# Altium schematic sheet top.SchDoc
size A4
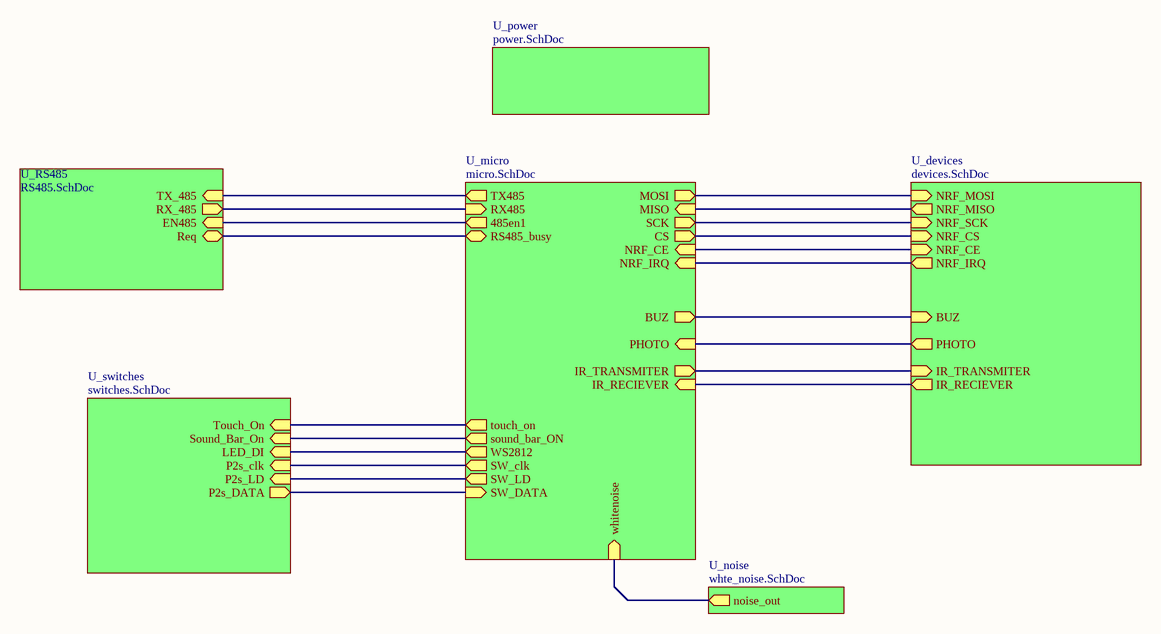
[diagram p0: top.SchDoc]

## Sub-sheets
U_devices = devices.SchDoc: NRF_MISO (out), NRF_SCK (in), NRF_CE (in), NRF_IRQ (out), NRF_CS (in), NRF_MOSI (in), BUZ (in), PHOTO (out), IR_RECIEVER (out), IR_TRANSMITER (in)
U_micro = micro.SchDoc: whitenoise (in), RX485 (in), TX485 (out), 485en1 (out), RS485_busy (bidir), PHOTO (in), NRF_CE (in), WS2812 (out), NRF_IRQ (in), touch_on (out), IR_RECIEVER (in), IR_TRANSMITER (out), sound_bar_ON (out), MOSI (out), MISO (in), SCK (out), CS (out), BUZ (out), SW_DATA (in), SW_clk (out), SW_LD (out)
U_noise = whte_noise.SchDoc: noise_out (out)
U_power = power.SchDoc: no entries
U_RS485 = RS485.SchDoc: RX_485 (out), EN485 (in), TX_485 (in), Req (bidir)
U_switches = switches.SchDoc: P2s_clk (in), P2s_LD (in), P2s_DATA (out), LED_DI (in), Sound_Bar_On (in), Touch_On (in)

## Nets
(unnamed): sheet U_noise/noise_out, sheet U_micro/whitenoise
(unnamed): sheet U_RS485/RX_485, sheet U_micro/RX485
(unnamed): sheet U_RS485/EN485, sheet U_micro/485en1
(unnamed): sheet U_RS485/TX_485, sheet U_micro/TX485
(unnamed): sheet U_RS485/Req, sheet U_micro/RS485_busy
(unnamed): sheet U_switches/P2s_clk, sheet U_micro/SW_clk
(unnamed): sheet U_switches/P2s_LD, sheet U_micro/SW_LD
(unnamed): sheet U_switches/P2s_DATA, sheet U_micro/SW_DATA
(unnamed): sheet U_switches/LED_DI, sheet U_micro/WS2812
(unnamed): sheet U_switches/Sound_Bar_On, sheet U_micro/sound_bar_ON
(unnamed): sheet U_switches/Touch_On, sheet U_micro/touch_on
(unnamed): sheet U_micro/PHOTO, sheet U_devices/PHOTO
(unnamed): sheet U_micro/NRF_CE, sheet U_devices/NRF_CE
(unnamed): sheet U_micro/NRF_IRQ, sheet U_devices/NRF_IRQ
(unnamed): sheet U_micro/IR_RECIEVER, sheet U_devices/IR_RECIEVER
(unnamed): sheet U_micro/IR_TRANSMITER, sheet U_devices/IR_TRANSMITER
(unnamed): sheet U_micro/MOSI, sheet U_devices/NRF_MOSI
(unnamed): sheet U_micro/MISO, sheet U_devices/NRF_MISO
(unnamed): sheet U_micro/SCK, sheet U_devices/NRF_SCK
(unnamed): sheet U_micro/CS, sheet U_devices/NRF_CS
(unnamed): sheet U_micro/BUZ, sheet U_devices/BUZ